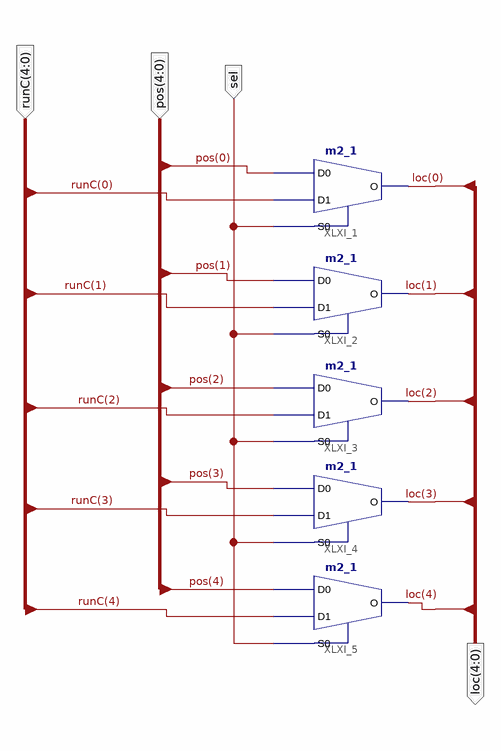
[diagram p0: schematic sheet 1]
// Xilinx ISE schematic memPOSMex.sch (spartan3e) as structural Verilog: 5 symbols, 4 ports
module memPOSMex (
  input  [4:0] pos,
  input  [4:0] runC,
  input  sel,
  output [4:0] loc
);

  m2_1 XLXI_1 (.D0(pos[0]), .D1(runC[0]), .S0(sel), .O(loc[0]));
  m2_1 XLXI_2 (.D0(pos[1]), .D1(runC[1]), .S0(sel), .O(loc[1]));
  m2_1 XLXI_3 (.D0(pos[2]), .D1(runC[2]), .S0(sel), .O(loc[2]));
  m2_1 XLXI_4 (.D0(pos[3]), .D1(runC[3]), .S0(sel), .O(loc[3]));
  m2_1 XLXI_5 (.D0(pos[4]), .D1(runC[4]), .S0(sel), .O(loc[4]));
endmodule
